# Altium schematic sheet ATmega_3000.14.SchDoc
size A3
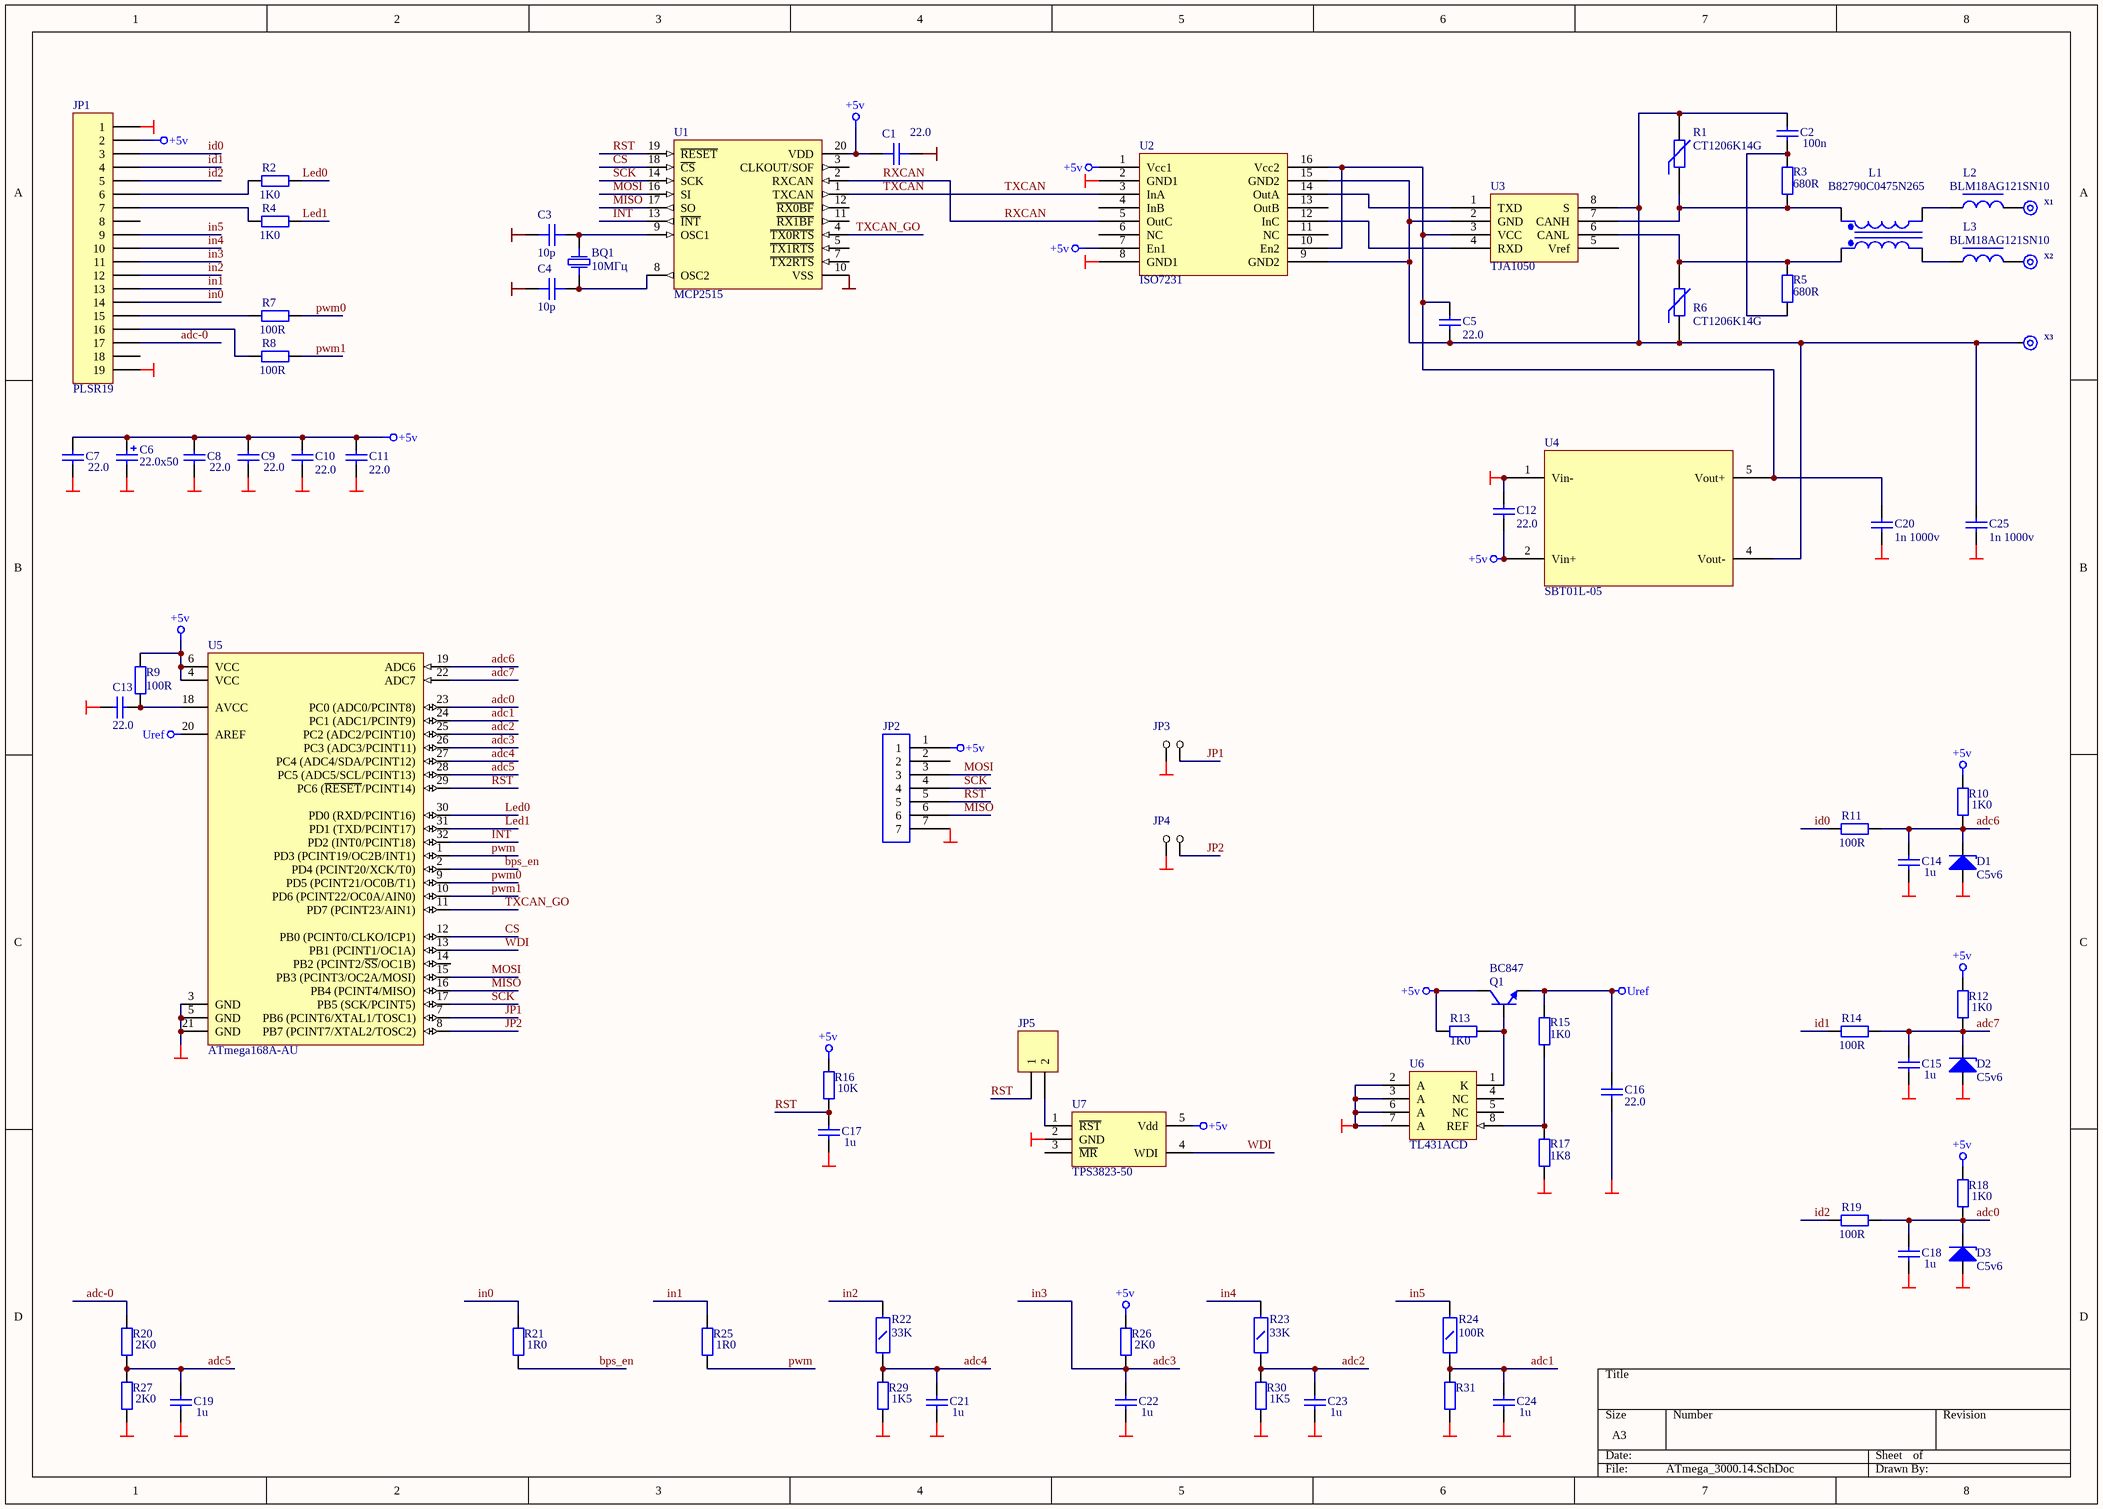
[diagram p0: ATmega_3000.14.SchDoc]

## Parts
BQ1  10МГц  [HC-49SMD]
C1  22.0  [C_1206]
C2  100n  [0603]
C3  10p  [0603]
C4  10p  [0603]
C5  22.0  [_1206]
C6  22.0x50  [C_5d_2pad]
C7  22.0  [_1206]
C8  22.0  [_1206]
C9  22.0  [_1206]
C10  22.0  [_1206]
C11  22.0  [_1206]
C12  22.0  [_1206]
C13  22.0  [_1206]
C14  1u  [0603]
C15  1u  [0603]
C16  22.0  [_1206]
C17  1u  [0603]
C18  1u  [0603]
C19  1u  [0603]
C20  1n 1000v  [_1206]
C21  1u  [0603]
C22  1u  [0603]
C23  1u  [0603]
C24  1u  [0603]
C25  1n 1000v  [_1206]
D1  C5v6  [SM/D_1406]
D2  C5v6  [SM/D_1406]
D3  C5v6  [SM/D_1406]
JP1  PLSR19  [HDR1X19]
JP2  PLSF-7  [HDR1X7]  (value not drawn)
JP3  JMP  [HDR1X2]  (value not drawn)
JP4  JMP  [HDR1X2]  (value not drawn)
JP5  PLS2  [HDR1X2]  (value not drawn)
L1  B82790C0475N265  [B82790]
L2  BLM18AG121SN10  [0603]
L3  BLM18AG121SN10  [0603]
Q1  BC847  [SOT23]
R1  CT1206K14G  [1206]
R2  1K0  [0603]
R3  680R  [0603]
R4  1K0  [0603]
R5  680R  [0603]
R6  CT1206K14G  [1206]
R7  100R  [0603]
R8  100R  [0603]
R9  100R  [0603]
R10  1K0  [0603]
R11  100R  [0603]
R12  1K0  [0603]
R13  1K0  [0603]
R14  100R  [0603]
R15  1K0  [0603]
R16  10K  [0603]
R17  1K8  [0603]
R18  1K0  [0603]
R19  100R  [0603]
R20  2K0  [0603]
R21  1R0  [0603]
R22  33K  [1206]
R23  33K  [1206]
R24  100R  [1206]
R25  1R0  [0603]
R26  2K0  [0603]
R27  2K0  [0603]
R29  1K5  [0603]
R30  1K5  [0603]
R31  (no value)  [0603]
U1  MCP2515  [TSSOP-ST20_N]
U2  ISO7231  [DW16_N]
U3  TJA1050  [SOIC-8-1.27-L.200]
U4  SBT01L-05  [SBT01L]
U5  ATmega168A-AU  [32A_N]
U6  TL431ACD  [SO-G8]
U7  TPS3823-50  [SO-G5/P.95]
X1  (no value)  [PIN2R]
X2  (no value)  [PIN2R]
X3  (no value)  [PIN2R]

## Nets
+5v: C1.2 C6.+ C7.2 C8.2 C9.2 C10.1 C11.1 C12.2 JP1.2 JP2.1 Q1.2(C) R9.1 R10.1 R12.1 R13.1 R16.1 R18.1 R26.2 U1.20(VDD) U2.1(Vcc1) U2.7(En1) U4.2(Vin+) U5.4(VCC) U5.6(VCC) U7.5(Vdd)
GND: C1.1 C3.1 C4.1 C6.- C7.1 C8.1 C9.1 C10.2 C11.2 C12.1 C13.1 C14.1 C15.1 C16.1 C17.1 C18.1 C19.1 C20.2 C21.1 C22.1 C23.1 C24.1 C25.2 D1.+ D2.+ D3.+ JP1.1 JP1.19 JP2.7 JP3.1 JP4.1 R17.1 R27.1 R29.1 R30.1 R31.1 U1.10(VSS) U2.2(GND1) U2.8(GND1) U4.1(Vin-) U5.3(GND) U5.5(GND) U5.21(GND) U6.2(A) U6.3(A) U6.6(A) U6.7(A) U7.2(GND)
Uref: C16.2 Q1.3(E) R15.2 U5.20(AREF)
adc0: C18.2 D3.- R18.2 R19.1 U5.23(PC0_(ADC0/PCINT8))
adc1: C24.2 R24.2 R31.2 U5.24(PC1_(ADC1/PCINT9))
adc2: C23.2 R23.2 R30.2 U5.25(PC2_(ADC2/PCINT10))
adc3: C22.2 JP1.11 R26.1 U5.26(PC3_(ADC3/PCINT11))  [also labelled in3]
adc4: C21.2 R22.2 R29.2 U5.27(PC4_(ADC4/SDA/PCINT12))
adc5: C19.2 R20.1 R27.2 U5.28(PC5_(ADC5/SCL/PCINT13))
adc6: C14.2 D1.- R10.2 R11.1 U5.19(ADC6)
adc7: C15.2 D2.- R12.2 R14.1 U5.22(ADC7)
adc-0: JP1.17 R20.2
bps_en: R21.1 U5.2(PD4_(PCINT20/XCK/T0))
CS: U1.18(~{CS}) U5.12(PB0_(PCINT0/CLKO/ICP1))
id0: JP1.3 R11.2
id1: JP1.4 R14.2
id2: JP1.5 R19.2
in0: JP1.14 R21.2
in1: JP1.13 R25.2
in2: JP1.12 R22.1
in4: JP1.10 R23.1
in5: JP1.9 R24.1
INT: U1.13(~{INT}) U5.32(PD2_(INT0/PCINT18))
JP1: JP3.2 U5.7(PB6_(PCINT6/XTAL1/TOSC1))
JP2: JP4.2 U5.8(PB7_(PCINT7/XTAL2/TOSC2))
Led0: R2.2 U5.30(PD0_(RXD/PCINT16))
Led1: R4.2 U5.31(PD1_(TXD/PCINT17))
MISO: JP2.6 U1.17(SO) U5.16(PB4_(PCINT4/MISO))
MOSI: JP2.3 U1.16(SI) U5.15(PB3_(PCINT3/OC2A/MOSI))
pwm: R25.1 U5.1(PD3_(PCINT19/OC2B/INT1))
pwm0: R7.1 U5.9(PD5_(PCINT21/OC0B/T1))
pwm1: R8.1 U5.10(PD6_(PCINT22/OC0A/AIN0))
RST: C17.2 JP2.5 JP5.1 R16.2 U1.19(~{RESET}) U5.29(PC6_(~{RESET}/PCINT14))
RXCAN: U1.2(RXCAN) U2.5(OutC)
SCK: JP2.4 U1.14(SCK) U5.17(PB5_(SCK/PCINT5))
TXCAN: U1.1(TXCAN) U2.3(InA)
TXCAN_GO: U1.4(~{TX0RTS}) U5.11(PD7_(PCINT23/AIN1))
WDI: U5.13(PB1_(PCINT1/OC1A)) U7.4(WDI)
NetBQ1_1: BQ1.1 C3.2 U1.9(OSC1)
NetBQ1_2: BQ1.2 C4.2 U1.8(OSC2)
NetC2_1: C2.1 R3.2 R5.1
NetC2_2: C2.2 C5.2 C25.1 R1.2 R6.1 U2.9(GND2) U2.15(GND2) U3.2(GND) U3.8(S) U4.4(Vout-) X3.1
NetC5_1: C5.1 C20.1 U2.10(En2) U2.16(Vcc2) U3.3(VCC) U4.5(Vout+)
NetC13_2: C13.2 R9.2 U5.18(AVCC)
NetJP1_6: JP1.6 R2.1
NetJP1_7: JP1.7 R4.1
NetJP1_15: JP1.15 R7.2
NetJP1_16: JP1.16 R8.2
NetJP5_2: JP5.2 U7.1(~{RST})
NetL1_1: L1.1(Pri+) R1.1 R3.1 U3.7(CANH)
NetL1_2: L1.2(Sec+) R5.2 R6.2 U3.6(CANL)
NetL1_3: L1.3(Sec-) L3.1
NetL1_4: L1.4(Pri-) L2.1
NetL2_2: L2.2 X1.1
NetL3_2: L3.2 X2.1
NetQ1_1: Q1.1(B) R13.2 U6.1(K)
NetR15_1: R15.1 R17.2 U6.8(REF)
NetU2_12: U2.12(InC) U3.4(RXD)
NetU2_14: U2.14(OutA) U3.1(TXD)

Not connected (* = marked no-connect by the designer): JP1 8 18; JP2 2; U1 3(CLKOUT/SOF) 5(~{TX1RTS}) 7(~{TX2RTS}) 11(~{RX1BF}) 12(~{RX0BF}); U2 4(InB) 6(NC) 11(NC) 13(OutB); U3 5(Vref); U5 14(PB2_(PCINT2/~{SS}/OC1B)); U6 4(NC) 5(NC); U7 3(~{MR})

## Library data of the parts
BQ1 = BQ: Right: 20; Bottom: 20
C1 = C_SM_1206: value: 1u
C2 C5 C7-C25 = Cap Semi: Capacitor (Semiconductor SIM Model); Manufacturer: Generic Components; Class I: Passive; Value: 1,0; Published: 8-Jun-2000; Revision: July-2002: Re-released for DXP Platform.; Publisher: Altium Limited; Class II: Capacitor
C3 C4 = C_SM_1206: value: 10p
C6 = Cap Pol1: Polarized Capacitor (Radial); Manufacturer: Generic Components; Class I: Passive; Value: 22,0; Published: 8-Jun-2000; Revision: July-2002: Re-released for DXP Platform.; Publisher: Altium Limited; Class II: Capacitor
D1-D3 = Zener: Default Diode; Manufacturer: Generic Components; Class I: Discrete; Class II: Diode - Switching; Value: BZV55C5V6; Published: 8-Jun-2000; Revision: July-2002: Re-released for DXP Platform.; Publisher: Altium Limited
JP1 = Header 19: Header, 19-Pin; Manufacturer: Generic Components; Class I: Connector; Revision: July-2002: Re-released for DXP Platform.; Publisher: Altium Limited
JP2 = PLSF-7: Right: 20; Bottom: 80
JP5 = Header 2: Header, 2-Pin; Manufacturer: Generic Components; Class I: Connector; Revision: July-2002: Re-released for DXP Platform.; Publisher: Altium Limited
L1 = Trans Cupl: Transformer (Coupled Inductor Model); Published: 8-Jun-2000; LatestRevisionDate: 17-Jul-2002; LatestRevisionNote: Re-released for DXP Platform.; PackageReference: TRF_4; Publisher: Altium Limited; PackageDescription: Transformer; 4 Leads
L2 L3 = DR: L; value: BLM18AG121SN10
Q1 = BC847ALT1: General Purpose Transistor NPN Silicon; Manufacturer: Motorola; Package Information: Latest Revision: 1997; Class I: Discrete; Class II: BJT - Low Power; Published: 29-Sep-2000; Revision: July-2002: Re-released for DXP Platform.; Datasheet: Latest Revision: 1997; Package Reference: 318-08; Publisher: Altium Limited
R1 R6 = Res Varistor: Varistor (Voltage-Sensitive Resistor); Manufacturer: Generic Components; Class I: Discrete; Published: 24-Mar-1999; Revision: July-2002: Re-released for DXP Platform.; Publisher: Altium Limited; Class II: Voltage-Sensitive Resistor
R2 R4 R20 R21 R26 R27 R29-R31 = Res2: Resistor; Manufacturer: Generic Components; Class I: Passive; Value: 1K; Rule: Undefined; Published: 8-Jun-2000; Revision: July-2002: Re-released for DXP Platform.; Publisher: Altium Limited; Class II: Resistor
R3 R5 = Res2: Resistor; Manufacturer: Generic Components; Class I: Passive; Value: 120; Published: 8-Jun-2000; Revision: July-2002: Re-released for DXP Platform.; Publisher: Altium Limited; Class II: Resistor
R7-R10 R12 R18 = Res2: Resistor; Manufacturer: Generic Components; Class I: Passive; Value: 10K; Rule: Undefined; Published: 8-Jun-2000; Revision: July-2002: Re-released for DXP Platform.; Publisher: Altium Limited; Class II: Resistor
R11 R14 R16 R19 = Res2: Resistor; Manufacturer: Generic Components; Class I: Passive; Rule: Undefined; Published: 8-Jun-2000; Revision: July-2002: Re-released for DXP Platform.; Publisher: Altium Limited; Class II: Resistor
  R11 R14 R19: Value: 100R
  R16: Value: 10K
R13 R15 R17 = Res2: Resistor; Manufacturer: Generic Components; Class I: Passive; Value: 1K; Published: 8-Jun-2000; Revision: July-2002: Re-released for DXP Platform.; Publisher: Altium Limited; Class II: Resistor
R22-R24 = R_1206: value: value
R25 = Res2: Resistor; Manufacturer: Generic Components; Class I: Passive; Value: 15K; Rule: Undefined; Published: 8-Jun-2000; Revision: July-2002: Re-released for DXP Platform.; Publisher: Altium Limited; Class II: Resistor
U1 = MCP2515: Stand-Alone CAN Controller With SPI Interface, 20-Pin TSSOP, Industrial Temperature; DatasheetVersion: revF, Oct-2010; PackageVersion: revBB, Aug-2009; PackageReference: TSSOP-ST20; PackageDescription: 20-Lead Plastic Thin Shrink Small Outline (ST) - 4.4mm Body [TSSOP]; Code_JEDEC: MO-153-AC; ComponentLink1Description: Manufacturer URL; ComponentLink1URL: http://www.microchip.com/; ComponentLink2Description: Datasheet; ComponentLink2URL: http://ww1.microchip.com/downloads/en/DeviceDoc/21801f.pdf; ComponentLink3Description: Package Specification; ComponentLink3URL: http://www.microchip.com/stellent/groups/techpub_sg/documents/packagingspec/en012702.pdf
U4 = SBT01L
U5 = ATmega168A-AU: 8-bit AVR Microcontroller, 16KB Flash, 512 Bytes EEPROM, 1KB SRAM, 32-pin TQFP, Industrial Grade (-40°C to 85°C); Published: 1-Apr-2010; DatasheetVersion: revA, Jan-2010; PackageVersion: revB, Oct-2001; PackageReference: 32A; Publisher: Altium Limited; PackageDescription: 32-Lead, 7x7x1.0 mm Body, 0.8mm Lead Pitch, Thin Profile Plastic Quad Flat Package (TQFP); Supplier 1: Digi-Key; Supplier Part Number 1: ATMEGA168A-AU-ND; Supplier 2: Mouser; Supplier Part Number 2: 556-ATMEGA168A-AU; Code_JEDEC: MS-026-ABA; ComponentLink1Description: Manufacturer Link; ComponentLink1URL: http://www.atmel.com/products/avr/default.asp?; ComponentLink2Description: ATmega48A/48PA/88A/88PA/168A/168PA/328/328P Datasheet; ComponentLink2URL: http://www.atmel.com/dyn/resources/prod_documents/8271.pdf; ComponentLink3Description: ATmega48A/48PA/88A/88PA/168A/168PA/328/328P Summary; ComponentLink3URL: http://www.atmel.com/dyn/resources/prod_documents/8271S.pdf; ComponentLink4Description: Atmel.com Home; ComponentLink4URL: http://www.atmel.com
U6 = TL431ACD: Programmable Precision Reference; Manufacturer: Motorola; Class I: Power Management; Class II: Voltage Reference; Published: 15-Apr-2002; Datasheet: Linear and Interface Integrated Circuits, DL128 Rev2 (1988); Package Reference: 751-02; Publisher: Altium Limited
U7 = TPS3823: Reset IC; Manufacturer: National Semiconductor; Package Information: Latest Revision: Aug-1999; Class I: Power Management; Class II: Voltage Regulator; Value: TPS76333; Published: 15-Apr-2002; Datasheet: Latest Revision: Oct-1999; Package Reference: MA05B; Publisher: Altium Limited
X1-X3 = Socket_Ring: Socket; Manufacturer: Generic Components; Class I: Connector; Revision: July-2002: Re-released for DXP Platform.; Publisher: Altium Limited